# EAGLE design Orion CanSat Greece (EAGLE 9.2.2)
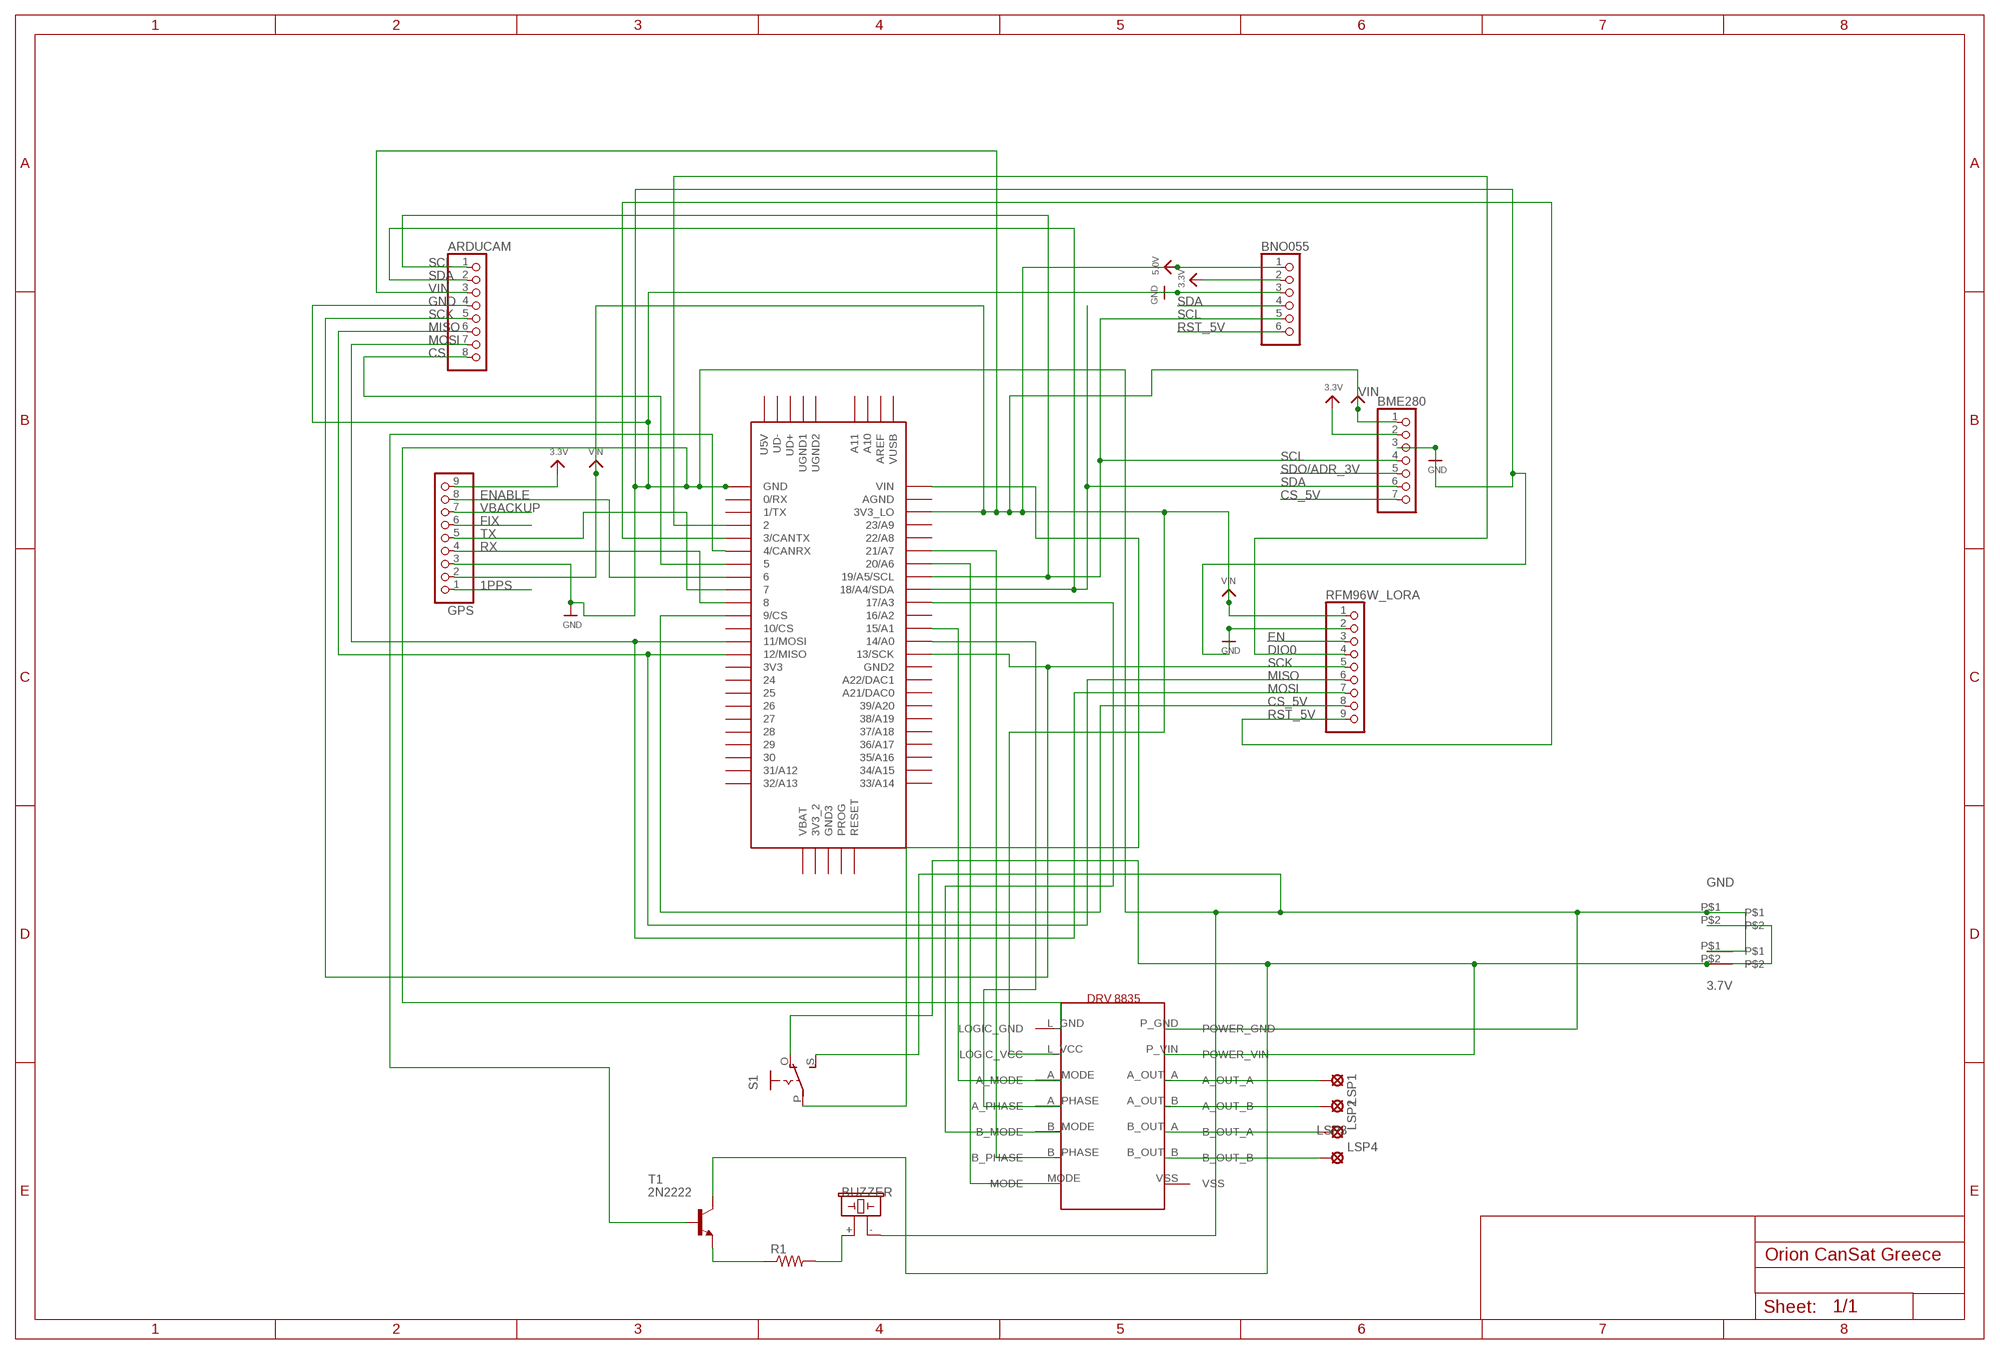
[diagram p0: schematic, sheet 1]

## Parts
ARDUCAM  PINHD-1X8BIG  [1X08-BIG]
BME280  HEADER-1X770MIL  [1X07_ROUND_70]
BNO055  HEADER-1X676MIL  [1X06_ROUND_76]
GPS  HEADER-1X970MIL  [1X09_ROUND_70]
LSP1  LSP13  [LSP13]
LSP2  LSP13  [LSP13]
LSP3  LSP13  [LSP13]
LSP4  LSP13  [LSP13]
R1  FLIPFLOP-RES  [0805-THM]
RFM96W_LORA  HEADER-1X970MIL  [1X09_ROUND_70]
S1  EG1218S  [EG1218]
SG2  F/CM12P  [F/CM12P]
T1  2N2222  [TO92-EBC-OVAL]
U$1  TEENSY_3.5/3.6  [TEENSY_3.5/3.6]
U$7  2PINS  [2PINS]
U$8  2PINS  [2PINS]
U$15  DRV8835  [DRV8835]

## Nets
1PPS: GPS.1
3.3V: BME280.2 BNO055.2 GPS.9
3V7: S1.P U$1.VIN
BZPWR: R1.2 SG2.+
CS: ARDUCAM.8 U$1.5
CS_5V: BME280.7 RFM96W_LORA.8 U$1.9/CS
DIO0: RFM96W_LORA.4 U$1.2
EN: RFM96W_LORA.3
ENABLE: GPS.8 U$1.6
FIX: GPS.6
GND: ARDUCAM.4 BME280.3 BNO055.3 GPS.3 RFM96W_LORA.2 S1.S SG2.- U$1.GND U$7.P$1 U$8.P$1 U$15.L_GND(LOGIC_GND) U$15.P_GND(POWER_GND)
MISO: ARDUCAM.6 RFM96W_LORA.6 U$1.12/MISO
MOSI: ARDUCAM.7 RFM96W_LORA.7 U$1.11/MOSI
N$1: R1.1 T1.E
N$2: U$1.20/A6 U$15.MODE
N$4: T1.B U$1.4/CANRX
N$5: U$1.21/A7 U$15.B_PHASE
N$6: U$1.14/A0 U$15.A_PHASE
N$7: U$1.15/A1 U$15.A_MODE
N$8: U$1.17/A3 U$15.B_MODE
N$9: LSP1.MP U$15.A_OUT_A
N$11: LSP2.MP U$15.A_OUT_B
N$12: LSP3.MP U$15.B_OUT_A
N$13: LSP4.MP U$15.B_OUT_B
RST_5V: BNO055.6 RFM96W_LORA.9 U$1.3/CANTX
RX: GPS.4 U$1.8
SCK: ARDUCAM.5 RFM96W_LORA.5 U$1.13/SCK
SCL: ARDUCAM.1 BME280.4 BNO055.5 U$1.19/A5/SCL
SDA: ARDUCAM.2 BME280.6 BNO055.4 U$1.18/A4/SDA
SDO/ADR_3V: BME280.5
TX: GPS.5 U$1.7
VBACKUP: GPS.7
VBAT: S1.O T1.C U$7.P$2 U$8.P$2 U$15.P_VIN(POWER_VIN)
VIN: ARDUCAM.3 BME280.1 BNO055.1 GPS.2 RFM96W_LORA.1 U$1.3V3_LO U$15.L_VCC(LOGIC_VCC) ; supply symbol labelled 5.0V
Unconnected: U$1.0/RX U$1.1/TX U$1.3V3 U$1.3V3_2 U$1.10/CS U$1.16/A2 U$1.21/DAC0(A21/DAC0) U$1.22/A8 U$1.23/A9 U$1.24 U$1.25 U$1.26 U$1.27 U$1.28 U$1.29 U$1.30 U$1.31/A12 U$1.32/A13 U$1.33/A14 U$1.34/A15 U$1.35/A16 U$1.36/A17 U$1.37/A18 U$1.38/A19 U$1.39/A20 U$1.A10 U$1.A11 U$1.A22/DAC1 U$1.AGND U$1.AREF U$1.GND2 U$1.GND3 U$1.PROG U$1.RESET U$1.U5V U$1.UD+ U$1.UD- U$1.UGND1 U$1.UGND2 U$1.VBAT U$1.VUSB U$15.VSS

## Notes on the sheet
- VIN
- 9V_BATTERY
- GND
- VIN | GND
- 3.7V
- BUZZER

## Library data of the parts
ARDUCAM = adafruit:PINHD-1X8: PIN HEADER
BME280 = microbuilder:HEADER-1X7: PIN HEADER
BNO055 = microbuilder:HEADER-1X6: PIN HEADER
GPS RFM96W_LORA = microbuilder:HEADER-1X9: PIN HEADER
LSP1-LSP4 = solpad:LSP13: SOLDER PAD drill 1.3 mm, distributor Buerklin, 12H562
R1 = adafruit:FLIPFLOP-RES: Flip Flop resistor An 0805 resistor inside a standard 1/4W 5% resistor. Makes for easy mods
S1 = switch:EG1218: SLIDING SWITCH 0.1" spacing through hole, vertical SPDT slide switch http://www.ladyada.net/library/pcb/eaglelibrary.html
SG2 = buzzer:F/CM12P: BUZZER Source: Buerklin; OC_FARNELL: unknown; OC_NEWARK: unknown
T1 = adafruit:2N2222: NPN TRANSISTOR Big oval pads
U$1 = teensy356:TEENSY_3.5/3.6
U$7 U$8 = 6pins:2PINS
U$15 = DRV 8835:DRV8835

## Board
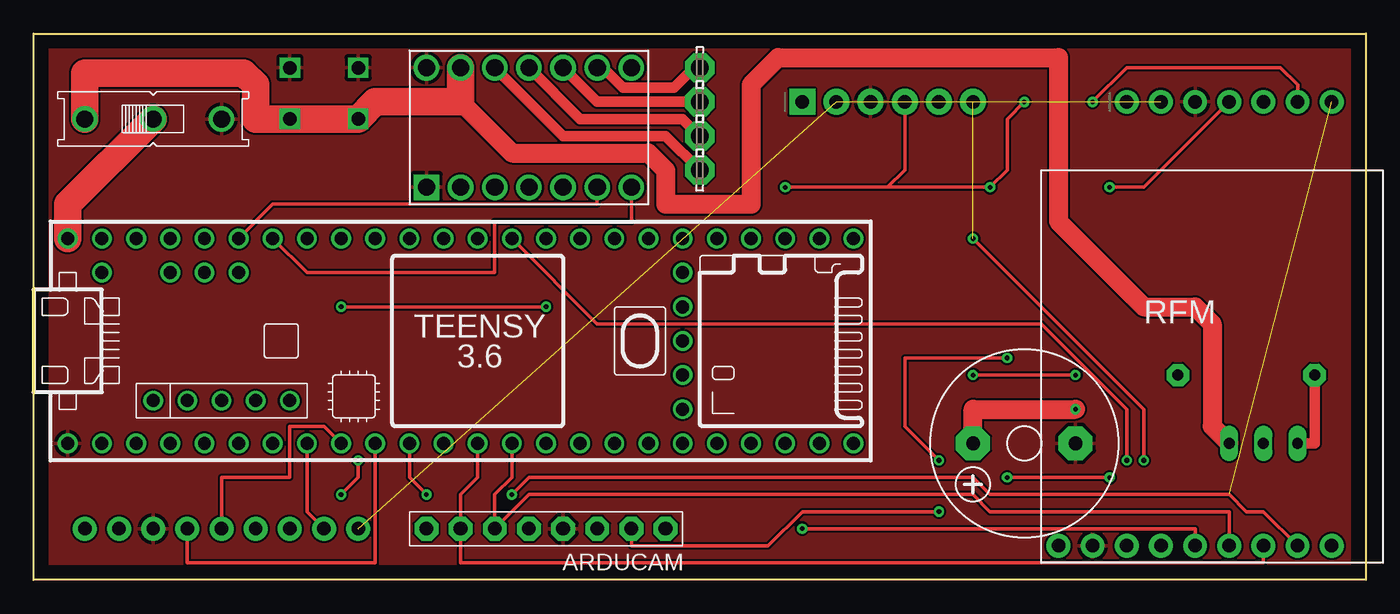
[diagram p1: board, top side]
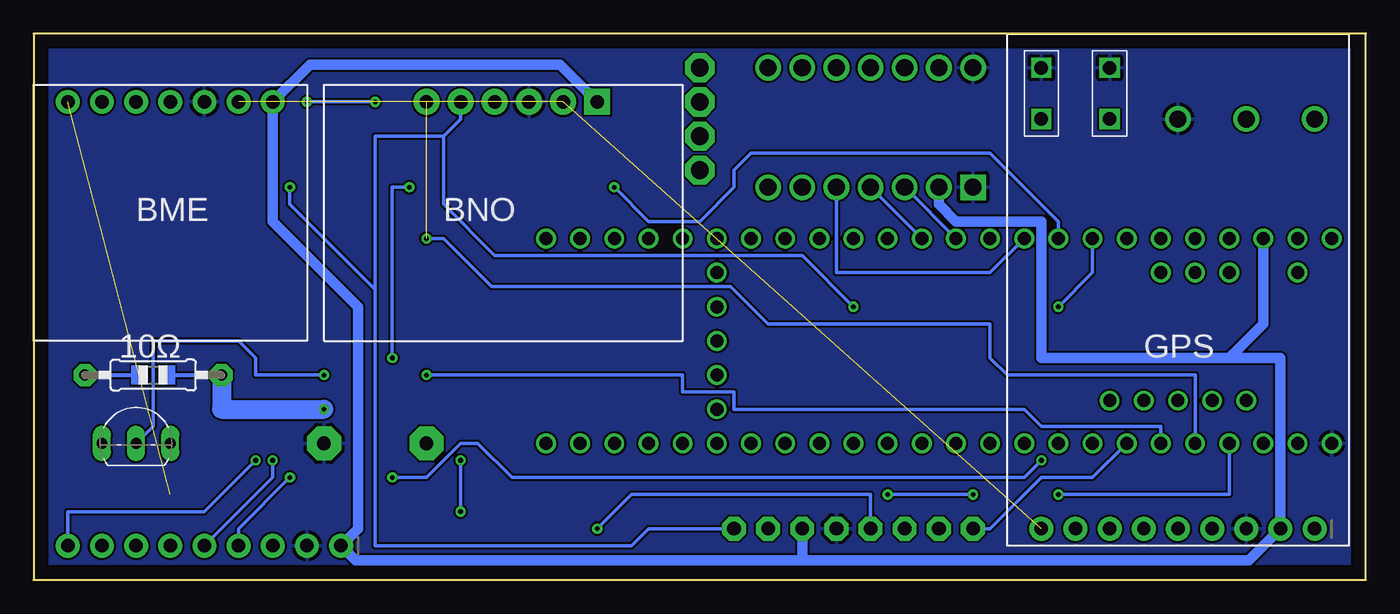
[diagram p2: board, bottom side, seen from below]

Size 99.06 x 40.64 mm. Coordinates in mm from the lower left corner, seen from the top.
Outline: 0,0 0,40.64 99.06,40.64 99.06,0 0,0
Copper layers (1*16): Top 0.035mm / dielectric 1.5mm / Bottom 0.035mm
Design rules "default": minimum track width 6mil, minimum drill 0.35mm, track to track 6mil, track to pad 6mil, pad to pad 6mil, via to via 6mil, smd to smd 6mil, copper to edge 40mil, drill to drill 6mil, minimum pad ring 10mil, minimum via ring 8mil, stop-mask expansion 4mil, vias tented up to drill 0mil, thermal gap 10mil

### Footprints (pad centres in the part's own frame; a part is rotated, then mirrored left to right if it is on the bottom)
1X08-BIG = drill 1.016 pad 1.778 octagon: 1 -8.89,0; 2 -6.35,0; 3 -3.81,0; 4 -1.27,0; 5 1.27,0; 6 3.81,0; 7 6.35,0; 8 8.89,0
1X07_ROUND_70 = drill 1 pad 1.778: 1 -7.62,0; 2 -5.08,0; 3 -2.54,0; 4 0,0; 5 2.54,0; 6 5.08,0; 7 7.62,0
1X06_ROUND_76 = drill 1 pad 1.93 square: 1 -6.35,0 | drill 1 pad 1.93: 2 -3.81,0; 3 -1.27,0; 4 1.27,0; 5 3.81,0; 6 6.35,0
1X09_ROUND_70 = drill 1 pad 1.778: 1 -10.16,0; 2 -7.62,0; 3 -5.08,0; 4 -2.54,0; 5 0,0; 6 2.54,0; 7 5.08,0; 8 7.62,0; 9 10.16,0
LSP13 = drill 1.321 pad 2.159 octagon: MP 0,0
0805-THM = drill 0.813 pad 1.676 octagon: 1 -5.08,0; 2 5.08,0
EG1218 = drill 1.27 pad 1.676: O -5.08,0; P 0,0; S 5.08,0
F/CM12P = drill 1.016 pad 2.54 octagon: + 3.81,0; - -3.81,0
TO92-EBC-OVAL = drill 0.813 long: B 0,-1.27; C 2.54,-1.27; E -2.54,-1.27
TEENSY_3.5/3.6 = drill 0.965: 0/RX -25.4,-7.62; 1/TX -22.86,-7.62; 2 -20.32,-7.62; 3/CANTX -17.78,-7.62; 3V3 7.62,-7.62; 3V3_2 17.78,-2.54; 3V3_LO -22.86,7.62; 4/CANRX -15.24,-7.62; 5 -12.7,-7.62; 6 -10.16,-7.62; 7 -7.62,-7.62; 8 -5.08,-7.62; 9/CS -2.54,-7.62; 10/CS 0,-7.62; 11/MOSI 2.54,-7.62; 12/MISO 5.08,-7.62; 13/SCK 5.08,7.62; 14/A0 2.54,7.62; 15/A1 0,7.62; 16/A2 -2.54,7.62; 17/A3 -5.08,7.62; 18/A4/SDA -7.62,7.62; 19/A5/SCL -10.16,7.62; 20/A6 -12.7,7.62; 21/A7 -15.24,7.62; 21/DAC0 12.7,7.62; 22/A8 -17.78,7.62; 23/A9 -20.32,7.62; 24 10.16,-7.62; 25 12.7,-7.62; 26 15.24,-7.62; 27 17.78,-7.62; 28 20.32,-7.62; 29 22.86,-7.62; 30 25.4,-7.62; 31/A12 27.94,-7.62; 32/A13 30.48,-7.62; 33/A14 30.48,7.62; 34/A15 27.94,7.62; 35/A16 25.4,7.62; 36/A17 22.86,7.62; 37/A18 20.32,7.62; 38/A19 17.78,7.62; 39/A20 15.24,7.62; A10 -17.78,5.08; A11 -15.24,5.08; A22/DAC1 10.16,7.62; AGND -25.4,7.62; AREF -20.32,5.08; GND -27.94,-7.62; GND2 7.62,7.62; GND3 17.78,0; PROG 17.78,2.54; RESET 17.78,5.08; U5V -21.59,-4.445; UD+ -16.51,-4.445; UD- -19.05,-4.445; UGND1 -13.97,-4.445; UGND2 -11.43,-4.445; VBAT 17.78,-5.08; VIN -27.94,7.62; VUSB -25.4,5.08
2PINS = drill 1 square: P$1 0,2.54; P$2 0,-1.27
DRV8835 = drill 1.27: A_MODE -3.81,3.81; A_OUT_A 5.08,3.81; A_OUT_B 5.08,1.27; A_PHASE -3.81,1.27; B_MODE -3.81,-1.27; B_OUT_A 5.08,-1.27; B_OUT_B 5.08,-3.81; B_PHASE -3.81,-3.81; L_VCC -3.81,6.35; MODE -3.81,-6.35; P_GND 5.08,8.89; P_VIN 5.08,6.35; VSS 5.08,-6.35 | drill 1.27 square: L_GND -3.81,8.89

### Placement (x,y rotation side)
ARDUCAM  38.1,3.81 180 top
BME280  88.9,35.56 0 top
BNO055  63.5,35.56 0 top
GPS  13.97,3.81 180 bottom
LSP1  49.53,30.48 270 top
LSP2  49.53,33.02 270 top
LSP3  49.53,35.56 270 top
LSP4  49.53,38.1 270 top
R1  90.17,15.24 0 bottom
RFM96W_LORA  86.36,2.54 180 bottom
S1  8.89,34.29 0 top
SG2  73.66,10.16 180 top
T1  91.44,11.43 0 bottom
U$1  30.48,17.78 0 top
U$7  19.05,35.56 0 top
U$8  24.13,35.56 0 top
U$15  38.1,33.02 90 top

### Tracks (layer width: path | path; a pad name or v marks a point on that pad's centre or on a via)
3.3V  (2 unrouted)
3V7
  Top 2.032: S1.P 2.54,27.94 U$1.VIN
BZPWR  (via drill 0.35)
  Top 1.397: SG2.+ 69.85,12.7 v77.47,12.7
  Bottom 1.397: v77.47,12.7 85.09,12.7 R1.2
CS
  Bottom 0.254: U$1.5 20.32,7.62 24.13,7.62 27.94,3.81 ARDUCAM.8
CS_5V  (via drill 0.35)  (1 unrouted)
  Top 0.254: RFM96W_LORA.8 91.44,5.08 90.17,5.08 88.9,6.35 71.12,6.35 69.85,7.62 36.83,7.62 v35.56,6.35 | v29.21,6.35 27.94,7.62 U$1.9/CS
  Bottom 0.254: v35.56,6.35 v29.21,6.35
DIO0  (via drill 0.35)
  Top 0.254: v72.39,7.62 v80.01,7.62 | v24.13,8.89 24.13,7.62 v22.86,6.35
  Bottom 0.254: U$1.2 10.16,6.35 v22.86,6.35 | v80.01,7.62 83.82,3.81 RFM96W_LORA.4 | v72.39,7.62 69.85,7.62 67.31,10.16 66.04,10.16 63.5,7.62 25.4,7.62 v24.13,8.89
ENABLE
  Top 0.254: U$1.6 20.32,5.08 GPS.8
GND
  pour Top: 101.6,41.91 101.6,-1.27 -1.27,-1.27 -1.27,41.91
  pour Bottom: -2.54,43.18 -2.54,-2.54 102.87,-2.54 102.87,43.18
MISO
  Top 0.254: U$1.12/MISO 35.56,7.62 34.29,6.35 ARDUCAM.6 36.83,6.35 69.85,6.35 71.12,5.08 88.9,5.08 RFM96W_LORA.6
MOSI
  Top 0.254: U$1.11/MOSI 33.02,7.62 31.75,6.35 ARDUCAM.7 31.75,1.27 91.44,1.27 RFM96W_LORA.7
N$1
  Top 0.762: R1.1 95.25,10.16 T1.E
N$2
  Top 0.254: U$15.MODE 44.45,26.67 34.29,26.67 34.29,22.86 20.32,22.86 U$1.20/A6
N$4  (via drill 0.35)
  Top 0.254: v77.47,15.24 v69.85,15.24
  Bottom 0.254: U$1.4/CANRX 15.24,11.43 24.13,11.43 25.4,12.7 46.99,12.7 46.99,13.97 50.8,13.97 50.8,15.24 v69.85,15.24 | v77.47,15.24 82.55,15.24 82.55,16.51 83.82,17.78 90.17,17.78 90.17,11.43 T1.B
N$5
  Top 0.254: U$15.B_PHASE 41.91,27.94 17.78,27.94 U$1.21/A7
N$6
  Bottom 0.254: U$15.A_PHASE U$1.14/A0
N$7
  Bottom 0.254: U$15.A_MODE U$1.15/A1
N$8
  Bottom 0.254: U$15.B_MODE 39.37,22.86 27.94,22.86 U$1.17/A3
N$9
  Top 0.762: U$15.A_OUT_A 39.37,33.02 46.99,33.02 LSP1.MP
N$11
  Top 0.762: U$15.A_OUT_B 40.64,34.29 48.26,34.29 LSP2.MP
N$12
  Top 0.762: U$15.B_OUT_A 41.91,35.56 LSP3.MP
N$13
  Top 0.762: U$15.B_OUT_B 42.35,38.1 43.84,36.61 47.6,36.61 49.09,38.1 LSP4.MP
RST_5V  (via drill 0.35)  (1 unrouted)
  Top 0.254: v82.55,8.89 82.55,12.7 v69.85,25.4
  Bottom 0.254: RFM96W_LORA.9 96.52,5.08 86.36,5.08 v82.55,8.89 | U$1.3/CANTX 12.7,15.24 26.67,15.24 27.94,16.51 27.94,19.05 44.45,19.05 47.24,21.84 65.02,21.84 68.58,25.4 v69.85,25.4
RX
  Top 0.254: GPS.4 11.43,1.27 25.4,1.27 U$1.8
SCK  (via drill 0.35)
  Top 0.254: v57.15,3.81 86.36,3.81 RFM96W_LORA.5 | v81.28,8.89 81.28,12.7 74.93,19.05 41.91,19.05 U$1.13/SCK
  Bottom 0.254: ARDUCAM.5 36.83,6.35 54.61,6.35 v57.15,3.81 | RFM96W_LORA.5 81.28,7.62 v81.28,8.89
SCL  (via drill 0.35)
  Top 0.254: BME280.4 82.55,29.21 v80.01,29.21 | v22.86,20.32 v38.1,20.32
  Bottom 0.254: ARDUCAM.1 53.34,3.81 54.61,2.54 73.66,2.54 73.66,21.59 | 73.66,21.59 73.66,33.02 68.58,33.02 | 73.66,21.59 80.01,27.94 v80.01,29.21 | U$1.19/A5/SCL 20.32,22.86 v22.86,20.32 | v38.1,20.32 41.91,24.13 64.77,24.13 68.58,27.94 68.58,33.02 | 68.58,33.02 67.31,34.29 BNO055.5
SDA  (via drill 0.35)
  Top 0.254: ARDUCAM.2 44.45,2.54 54.61,2.54 57.15,5.08 v67.31,5.08 | v67.31,8.89 64.77,11.43 64.77,16.51 v72.39,16.51 | 63.5,29.21 v71.12,29.21 72.39,30.48 72.39,34.29 v73.66,35.56 | 63.5,29.21 v55.88,29.21 | 63.5,29.21 64.77,30.48 BNO055.4 | BME280.6 93.98,36.83 92.71,38.1 81.28,38.1 v78.74,35.56
  Bottom 0.254: v67.31,5.08 v67.31,8.89 | v72.39,16.51 72.39,29.21 v71.12,29.21 | U$1.18/A4/SDA 22.86,26.67 27.94,31.75 45.72,31.75 46.99,30.48 46.99,29.21 49.53,26.67 53.34,26.67 v55.88,29.21 | v78.74,35.56 v73.66,35.56
TX
  Top 0.254: GPS.5 13.97,7.62 19.05,7.62 19.05,11.43 21.59,11.43 U$1.7
VBAT
  Top 1.397: 31.75,35.56 35.56,31.75 45.72,31.75 46.99,30.48 46.99,27.94 53.34,27.94 53.34,36.83 55.36,38.85 76.2,38.85 76.2,26.67 82.55,20.32 86.36,20.32 87.63,19.05 87.63,11.43 T1.C
  Top 2.032: S1.O 3.81,37.71 15.63,37.71 16.51,36.83 16.51,34.29 U$7.P$2 U$8.P$2 25.4,35.56 31.75,35.56 U$15.P_VIN
VIN
  Bottom 0.762: U$1.3V3_LO 7.62,19.05 10.16,16.51 | 41.91,1.47 8.69,1.47 GPS.2 6.35,16.51 10.16,16.51 | 41.91,1.47 ARDUCAM.3 | 41.91,1.47 75.13,1.47 RFM96W_LORA.1 74.93,3.81 74.93,20.32 81.28,26.67 BME280.1 78.51,38.33 59.92,38.33 BNO055.1 | 10.16,16.51 24.13,16.51 24.13,26.67 30.48,26.67 31.75,27.94 U$15.L_VCC

### Text on the board
tNames: RFM
bNames: BNO | BME | GPS | 10Ω